# Altium schematic sheet BatCollector.SchDoc
size A4
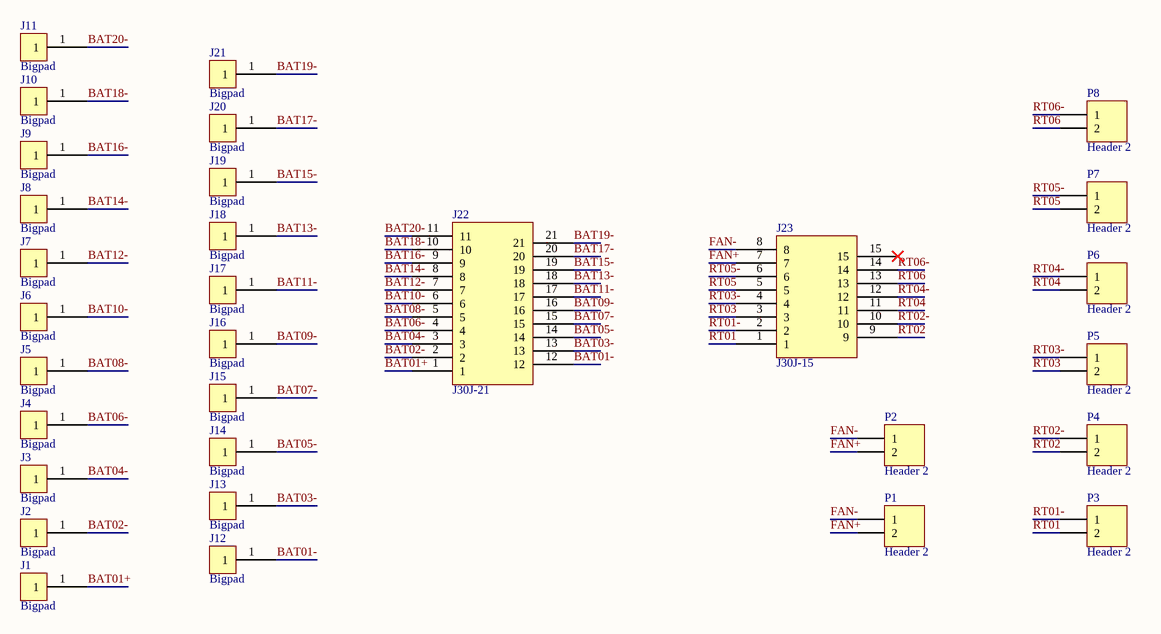
[diagram p0: BatCollector.SchDoc]

## Parts
J1  Bigpad  [Bigpad]
J2  Bigpad  [Bigpad]
J3  Bigpad  [Bigpad]
J4  Bigpad  [Bigpad]
J5  Bigpad  [Bigpad]
J6  Bigpad  [Bigpad]
J7  Bigpad  [Bigpad]
J8  Bigpad  [Bigpad]
J9  Bigpad  [Bigpad]
J10  Bigpad  [Bigpad]
J11  Bigpad  [Bigpad]
J12  Bigpad  [Bigpad]
J13  Bigpad  [Bigpad]
J14  Bigpad  [Bigpad]
J15  Bigpad  [Bigpad]
J16  Bigpad  [Bigpad]
J17  Bigpad  [Bigpad]
J18  Bigpad  [Bigpad]
J19  Bigpad  [Bigpad]
J20  Bigpad  [Bigpad]
J21  Bigpad  [Bigpad]
J22  J30J-21  [J30J-21]
J23  J30J-15  [J30J-15]
P1  Header 2  [HDR1X2]
P2  Header 2  [HDR1X2]
P3  Header 2  [HDR1X2]
P4  Header 2  [HDR1X2]
P5  Header 2  [HDR1X2]
P6  Header 2  [HDR1X2]
P7  Header 2  [HDR1X2]
P8  Header 2  [HDR1X2]

## Nets
BAT01+: J1.1 J22.1
BAT01-: J12.1 J22.12
BAT02-: J2.1 J22.2
BAT03-: J13.1 J22.13
BAT04-: J3.1 J22.3
BAT05-: J14.1 J22.14
BAT06-: J4.1 J22.4
BAT07-: J15.1 J22.15
BAT08-: J5.1 J22.5
BAT09-: J16.1 J22.16
BAT10-: J6.1 J22.6
BAT11-: J17.1 J22.17
BAT12-: J7.1 J22.7
BAT13-: J18.1 J22.18
BAT14-: J8.1 J22.8
BAT15-: J19.1 J22.19
BAT16-: J9.1 J22.9
BAT17-: J20.1 J22.20
BAT18-: J10.1 J22.10
BAT19-: J21.1 J22.21
BAT20-: J11.1 J22.11
FAN+: J23.7 P1.2 P2.2
FAN-: J23.8 P1.1 P2.1
RT01: J23.1 P3.2
RT01-: J23.2 P3.1
RT02: J23.9 P4.2
RT02-: J23.10 P4.1
RT03: J23.3 P5.2
RT03-: J23.4 P5.1
RT04: J23.11 P6.2
RT04-: J23.12 P6.1
RT05: J23.5 P7.2
RT05-: J23.6 P7.1
RT06: J23.13 P8.2
RT06-: J23.14 P8.1

Not connected (* = marked no-connect by the designer): J23 15*

## Library data of the parts
P1-P8 = Header 2: Header, 2-Pin; LatestRevisionDate: 17-Jul-2002; LatestRevisionNote: Re-released for DXP Platform.; Publisher: Altium Limited